# EAGLE design drive_new2 (EAGLE 9.5.0)
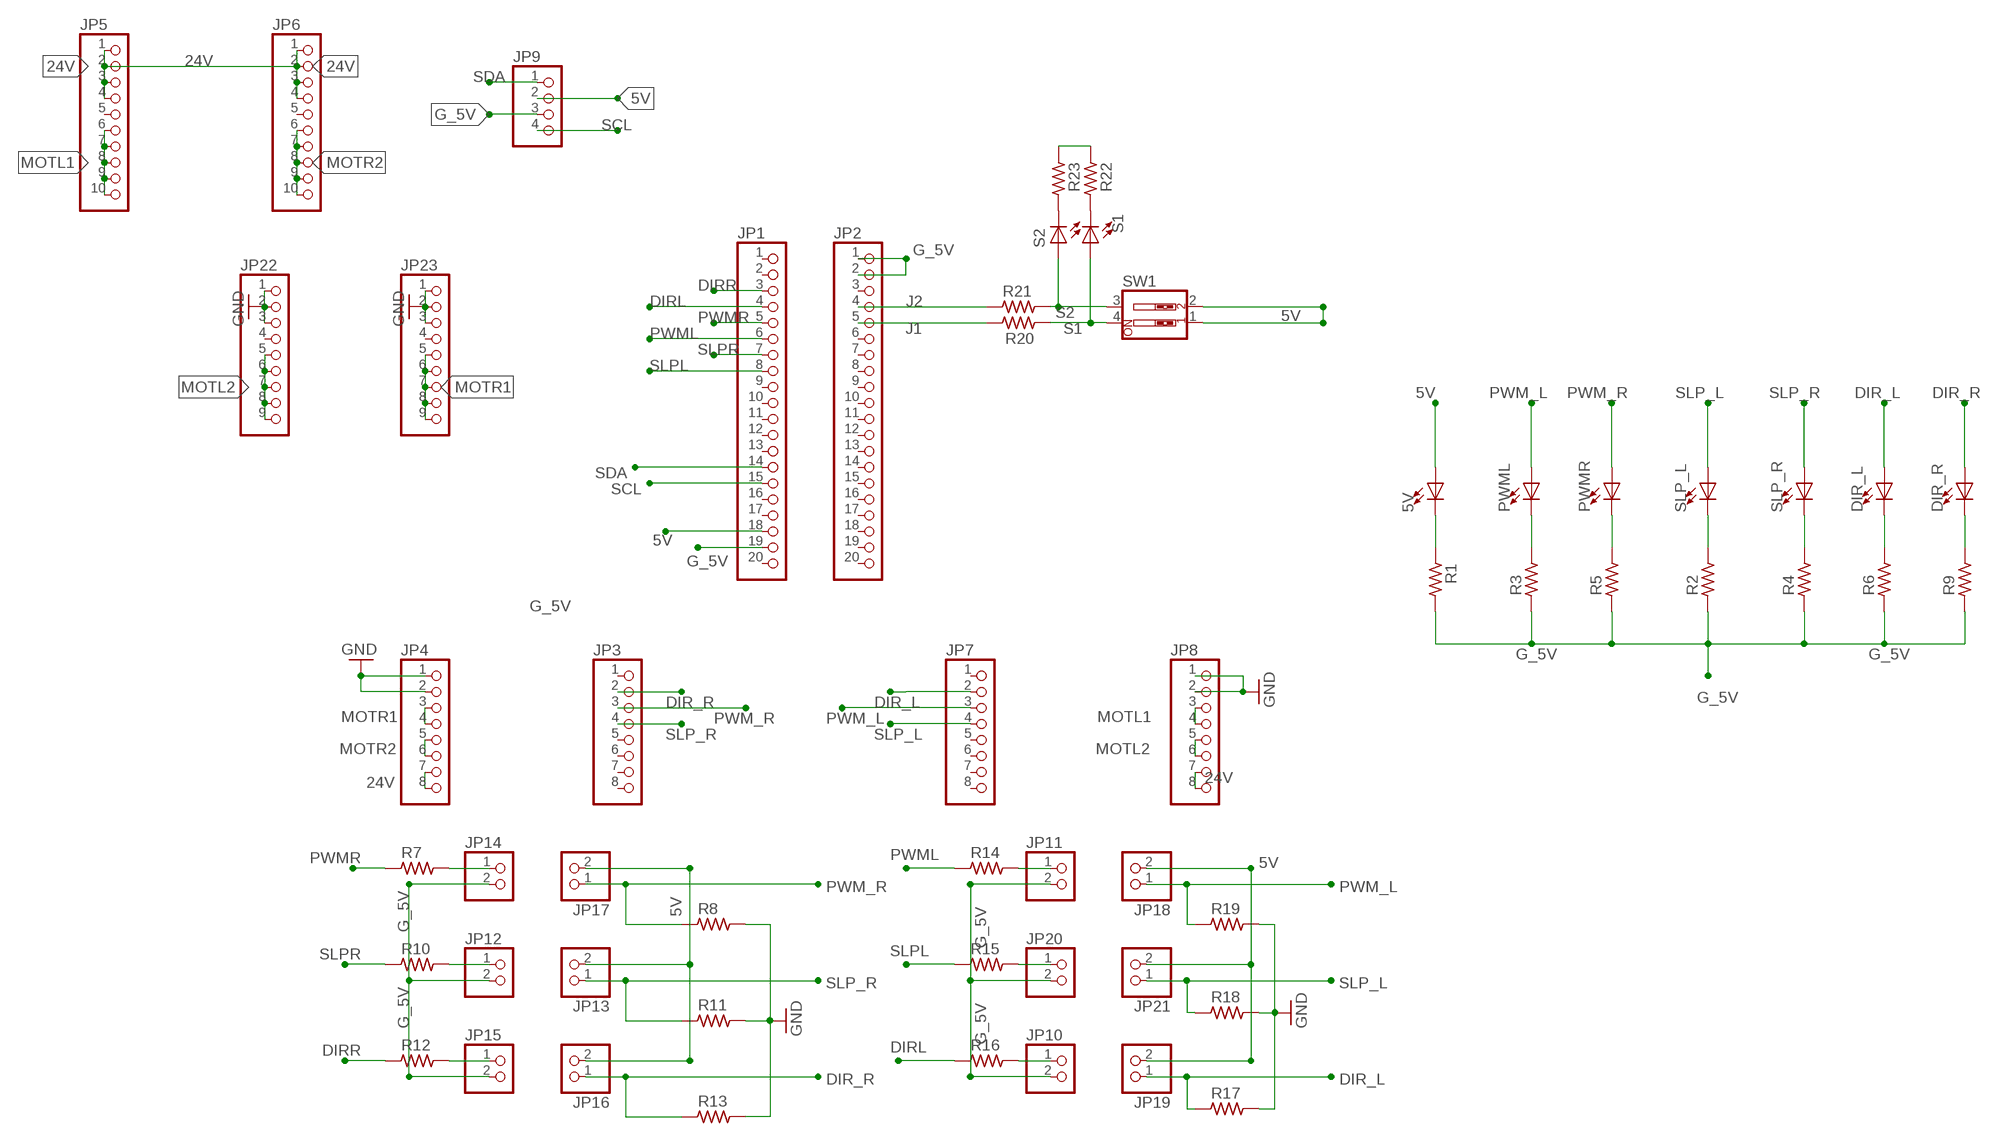
[diagram p0: schematic, sheet 1]

## Parts
5V  RED  LED_E  [LED_1206]
DIR_L  BLUE  LED_E  [LED_1206]
DIR_R  BLUE  LED_E  [LED_1206]
JP1  PINHD-1X20  [1X20]
JP2  PINHD-1X20  [1X20]
JP3  PINHD-1X8  [1X08]
JP4  PINHD-1X8  [1X08]
JP5  PINHD-1X10  [1X10]
JP6  PINHD-1X10  [1X10]
JP7  PINHD-1X8  [1X08]
JP8  PINHD-1X8  [1X08]
JP9  PINHD-1X4  [1X04]
JP10  PINHD-1X2  [1X02]
JP11  PINHD-1X2  [1X02]
JP12  PINHD-1X2  [1X02]
JP13  PINHD-1X2  [1X02]
JP14  PINHD-1X2  [1X02]
JP15  PINHD-1X2  [1X02]
JP16  PINHD-1X2  [1X02]
JP17  PINHD-1X2  [1X02]
JP18  PINHD-1X2  [1X02]
JP19  PINHD-1X2  [1X02]
JP20  PINHD-1X2  [1X02]
JP21  PINHD-1X2  [1X02]
JP22  PINHD-1X9  [1X09]
JP23  PINHD-1X9  [1X09]
PWML  RED  LED_E  [LED_1206]
PWMR  RED  LED_E  [LED_1206]
R1  R_0805  [R0805]
R2  R_0805  [R0805]
R3  R_0805  [R0805]
R4  R_0805  [R0805]
R5  R_0805  [R0805]
R6  R_0805  [R0805]
R7  R_0805  [R0805]
R8  R_0805  [R0805]
R9  R_0805  [R0805]
R10  R_0805  [R0805]
R11  R_0805  [R0805]
R12  R_0805  [R0805]
R13  R_0805  [R0805]
R14  R_0805  [R0805]
R15  R_0805  [R0805]
R16  R_0805  [R0805]
R17  R_0805  [R0805]
R18  R_0805  [R0805]
R19  R_0805  [R0805]
R20  R_0805  [R0805]
R21  R_0805  [R0805]
R22  R_0805  [R0805]
R23  R_0805  [R0805]
S1  RED  LED_E  [LED_1206]
S2  RED  LED_E  [LED_1206]
SLP_L  BLUE  LED_E  [LED_1206]
SLP_R  BLUE  LED_E  [LED_1206]
SW1  SW_DIP-2  [EDG-02]

## Nets
5V: 5V.A JP1.18 JP9.2 JP13.2 JP16.2 JP17.2 JP18.2 JP19.2 JP21.2 SW1.1 SW1.2
24V: JP4.7 JP4.8 JP5.1 JP5.2 JP5.3 JP5.4 JP6.1 JP6.2 JP6.3 JP6.4 JP8.7 JP8.8
DIR_L: DIR_L.A JP7.2 JP19.1 R17.1
DIR_R: DIR_R.A JP3.2 JP16.1 R13.1
DIRL: JP1.4 R16.1
DIRR: JP1.3 R12.1
G_5V: JP1.19 JP2.1 JP2.2 JP9.3 JP10.2 JP11.2 JP12.2 JP14.2 JP15.2 JP20.2 R1.2 R2.1 R3.1 R4.1 R5.1 R6.1 R9.1 R22.1 R23.1
GND: JP4.1 JP4.2 JP8.1 JP8.2 JP22.1 JP22.2 JP22.3 JP23.1 JP23.2 JP23.3 R8.2 R11.2 R13.2 R17.2 R18.2 R19.2
J1: JP2.5 R20.2
J2: JP2.4 R21.2
MOTL1: JP5.6 JP5.7 JP5.8 JP5.9 JP5.10 JP8.3 JP8.4
MOTL2: JP8.5 JP8.6 JP22.5 JP22.6 JP22.7 JP22.8 JP22.9
MOTR1: JP4.3 JP4.4 JP23.5 JP23.6 JP23.7 JP23.8 JP23.9
MOTR2: JP4.5 JP4.6 JP6.6 JP6.7 JP6.8 JP6.9 JP6.10
N$1: DIR_R.C R9.2
N$2: DIR_L.C R6.2
N$3: R4.2 SLP_R.C
N$4: R2.2 SLP_L.C
N$8: PWMR.C R5.2
N$9: PWML.C R3.2
N$10: 5V.C R1.1
N$11: JP14.1 R7.2
N$13: JP12.1 R10.2
N$14: R22.2 S1.C
N$15: JP15.1 R12.2
N$16: R23.2 S2.C
N$19: JP11.1 R14.2
N$20: JP20.1 R15.2
N$21: JP10.1 R16.2
PWM_L: JP7.3 JP18.1 PWML.A R19.1
PWM_R: JP3.3 JP17.1 PWMR.A R8.1
PWML: JP1.6 R14.1
PWMR: JP1.5 R7.1
S1: R20.1 S1.A SW1.4
S2: R21.1 S2.A SW1.3
SCL: JP1.15 JP9.4
SDA: JP1.14 JP9.1
SLP_L: JP7.4 JP21.1 R18.1 SLP_L.A
SLP_R: JP3.4 JP13.1 R11.1 SLP_R.A
SLPL: JP1.8 R15.1
SLPR: JP1.7 R10.1
Unconnected: JP1.1 JP1.2 JP1.9 JP1.10 JP1.11 JP1.12 JP1.13 JP1.16 JP1.17 JP1.20 JP2.3 JP2.6 JP2.7 JP2.8 JP2.9 JP2.10 JP2.11 JP2.12 JP2.13 JP2.14 JP2.15 JP2.16 JP2.17 JP2.18 JP2.19 JP2.20 JP3.1 JP3.5 JP3.6 JP3.7 JP3.8 JP5.5 JP6.5 JP7.1 JP7.5 JP7.6 JP7.7 JP7.8 JP22.4 JP23.4

## Library data of the parts
5V DIR_L DIR_R PWML PWMR S1 S2 SLP_L SLP_R = eagle-ltspice:LED_E: LED Source: http://www.osram.convergy.de Source: www.luxeon.com Source: www.kingbright.com; SPICEMODEL: NONE; SPICEPREFIX: D; SPICETYPE: diode
JP1 JP2 = pinhead:PINHD-1X20: PIN HEADER
JP3 JP4 JP7 JP8 = pinhead:PINHD-1X8: PIN HEADER
JP5 JP6 = pinhead:PINHD-1X10: PIN HEADER
JP9 = pinhead:PINHD-1X4: PIN HEADER
JP10-JP21 = pinhead:PINHD-1X2: PIN HEADER
JP22 JP23 = pinhead:PINHD-1X9: PIN HEADER
R1-R23 = rc-master-smd:R_: RESISTOR
SW1 = special:SW_DIP-2: DIP SWITCH

## Board
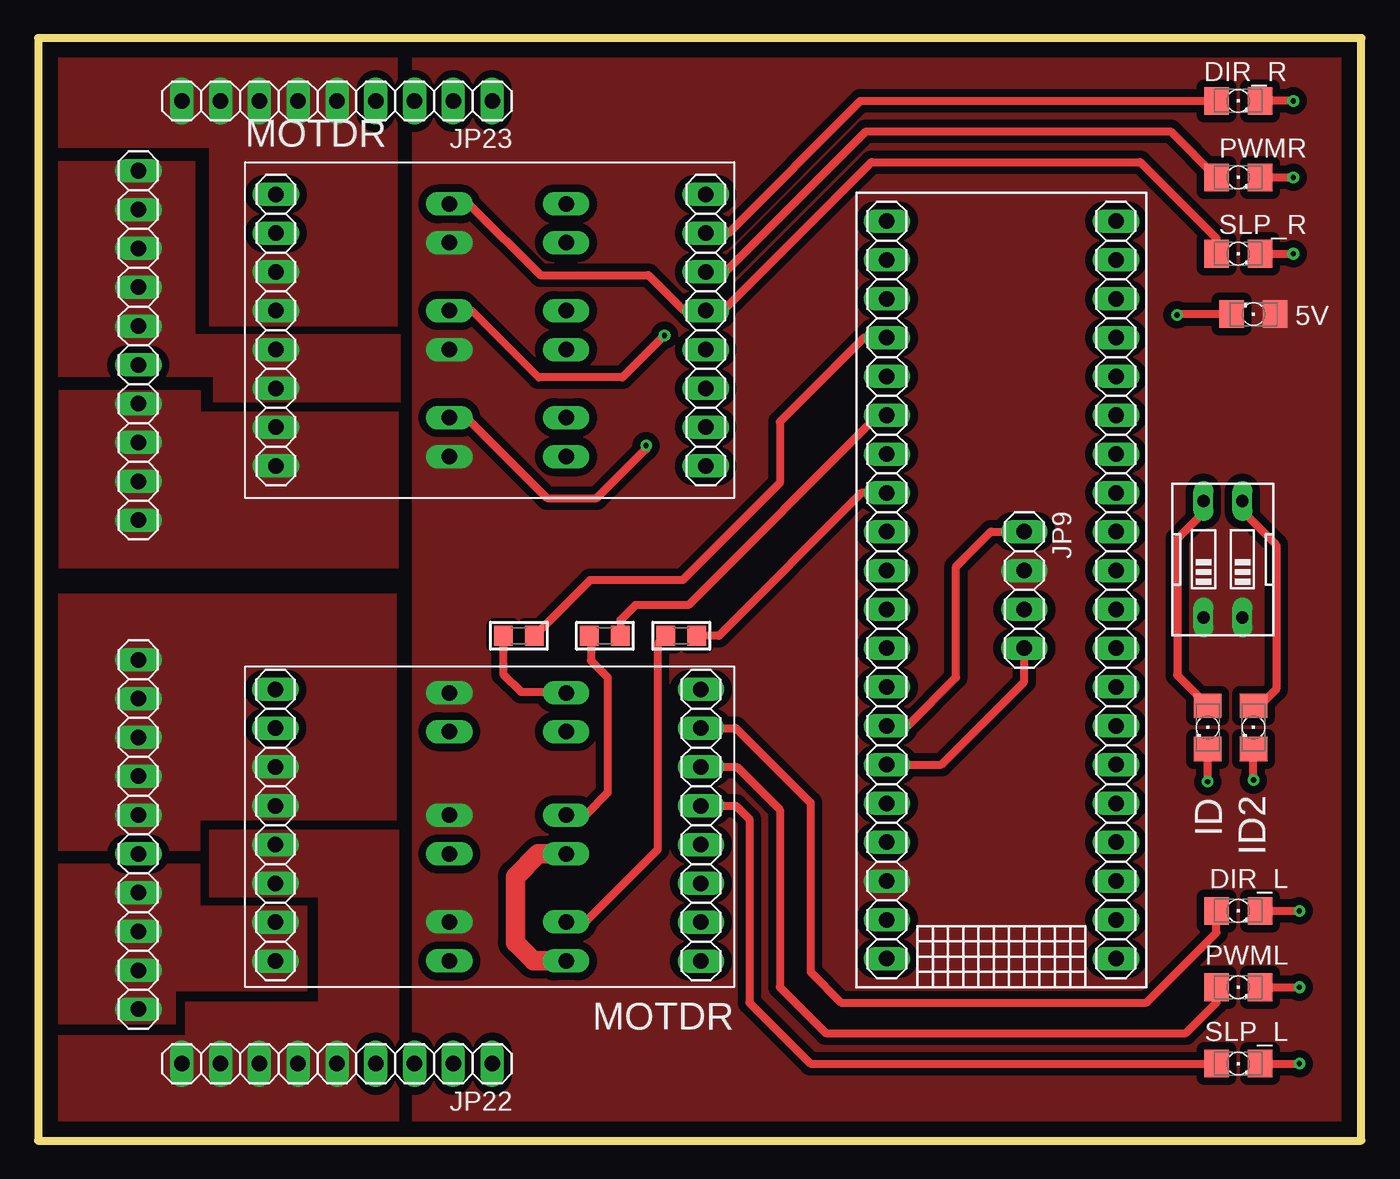
[diagram p1: board, top side]
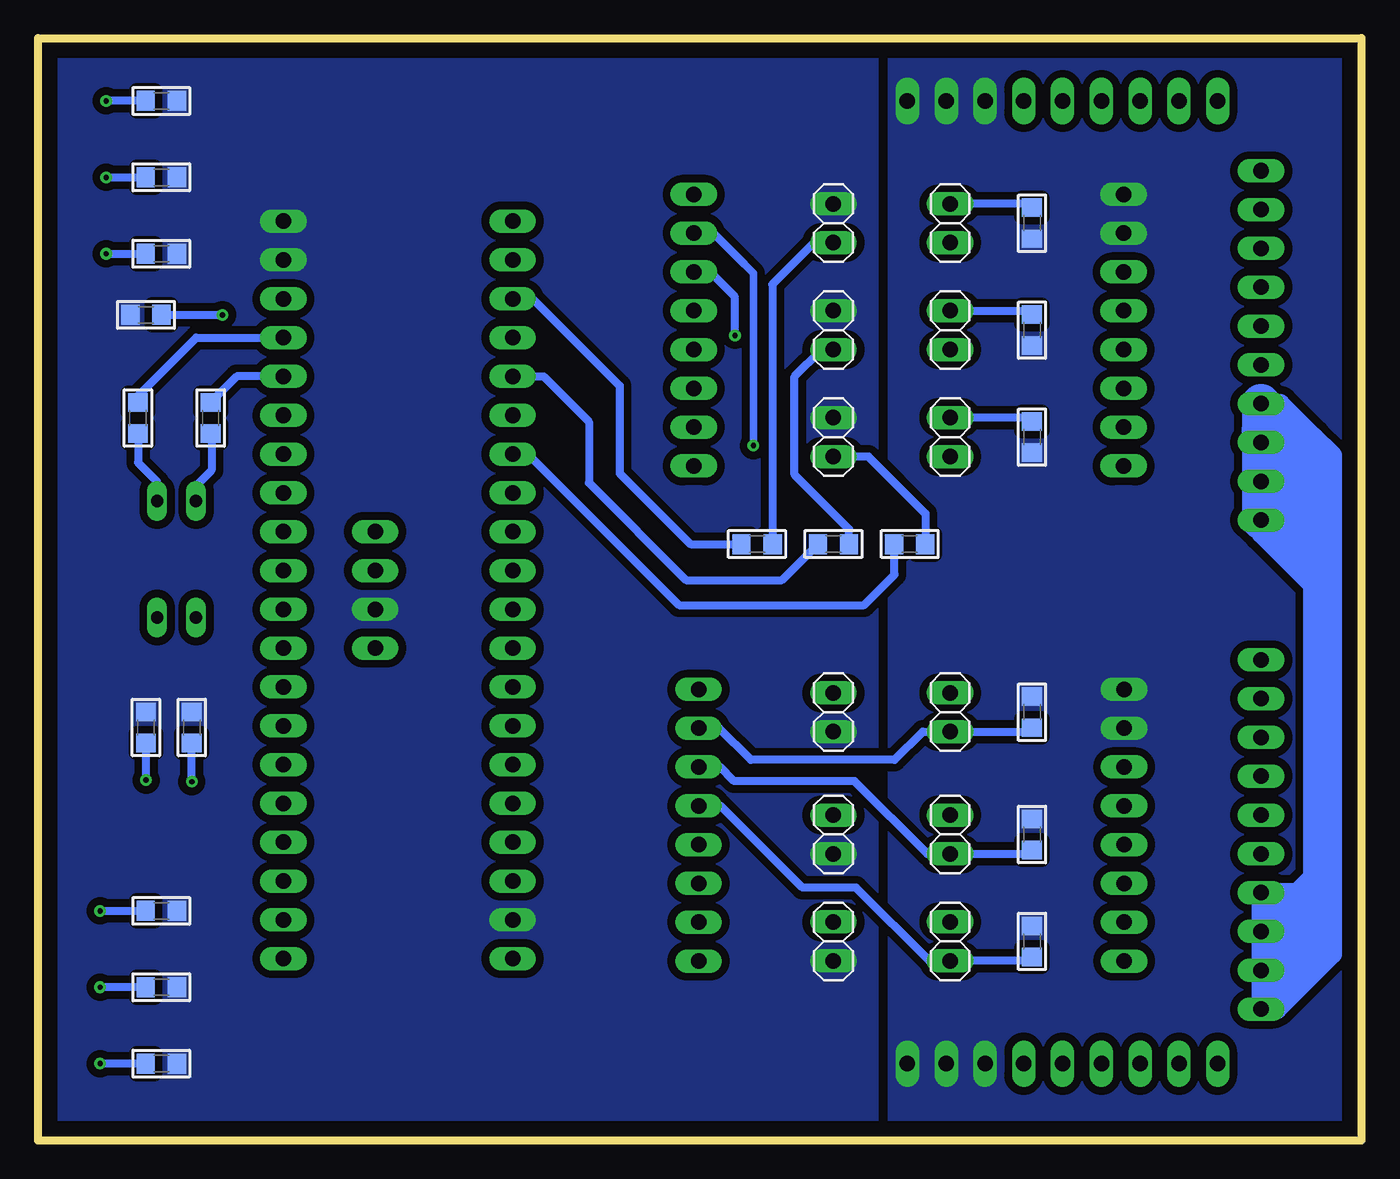
[diagram p2: board, bottom side, seen from below]

Size 86.61 x 72.14 mm. Coordinates in mm from the lower left corner, seen from the top.
Outline: 0,0 86.61,0 86.61,72.14 0,72.14 0,0
Copper layers (1*16): Top 0.035mm / dielectric 1.5mm / Bottom 0.035mm
Design rules "default *": minimum track width 6mil, minimum drill 0.35mm, track to track 20mil, track to pad 20mil, pad to pad 20mil, via to via 20mil, smd to smd 20mil, copper to edge 40mil, drill to drill 6mil, minimum pad ring 10mil, minimum via ring 8mil, stop-mask expansion 4mil, vias tented up to drill 0mil, thermal gap 10mil

### Footprints (pad centres in the part's own frame; a part is rotated, then mirrored left to right if it is on the bottom)
LED_1206 = smd 1.6 x 1.803: A -1.422,0; C 1.422,0
1X20 = drill 1.016 long: 1 -24.13,0; 2 -21.59,0; 3 -19.05,0; 4 -16.51,0; 5 -13.97,0; 6 -11.43,0; 7 -8.89,0; 8 -6.35,0; 9 -3.81,0; 10 -1.27,0; 11 1.27,0; 12 3.81,0; 13 6.35,0; 14 8.89,0; 15 11.43,0; 16 13.97,0; 17 16.51,0; 18 19.05,0; 19 21.59,0; 20 24.13,0
1X08 = drill 1.016 long: 1 -8.89,0; 2 -6.35,0; 3 -3.81,0; 4 -1.27,0; 5 1.27,0; 6 3.81,0; 7 6.35,0; 8 8.89,0
1X10 = drill 1.016 long: 1 -11.43,0; 2 -8.89,0; 3 -6.35,0; 4 -3.81,0; 5 -1.27,0; 6 1.27,0; 7 3.81,0; 8 6.35,0; 9 8.89,0; 10 11.43,0
1X04 = drill 1.016 long: 1 -3.81,0; 2 -1.27,0; 3 1.27,0; 4 3.81,0
1X02 = drill 1.016 long: 1 -1.27,0; 2 1.27,0
1X09 = drill 1.016 long: 1 -10.16,0; 2 -7.62,0; 3 -5.08,0; 4 -2.54,0; 5 0,0; 6 2.54,0; 7 5.08,0; 8 7.62,0; 9 10.16,0
R0805 = smd 1.2 x 1.3: 1 -1.016,0; 2 1.016,0
EDG-02 = drill 0.813 long: 1 -1.27,-3.81; 2 1.27,-3.81; 3 1.27,3.81; 4 -1.27,3.81

### Placement (x,y rotation side)
5V  79.56,54.08 180 top
DIR_L  78.56,15.03 0 top
DIR_R  78.56,68.03 0 top
JP1  55.56,36.03 270 top
JP2  70.56,36.03 270 top
JP3  43.7,53.03 270 top
JP4  15.56,53.03 270 top
JP5  6.56,20.03 90 top
JP6  6.56,52.03 90 top
JP7  43.39,20.64 270 top
JP8  15.53,20.64 270 top
JP9  64.56,36.03 270 top
JP10  34.56,28.03 270 bottom
JP11  34.56,20.03 270 bottom
JP12  34.56,46.03 90 bottom
JP13  26.92,60.03 270 bottom
JP14  34.56,53.03 90 bottom
JP15  34.56,60.03 90 bottom
JP16  26.92,46.03 270 bottom
JP17  26.92,53.03 270 bottom
JP18  26.92,20.03 90 bottom
JP19  26.92,28.03 90 bottom
JP20  34.56,13.03 270 bottom
JP21  26.92,13.03 90 bottom
JP22  19.56,5.03 180 top
JP23  19.56,68.03 180 top
PWML  78.56,10.03 0 top
PWMR  78.56,63.03 0 top
R1  79.56,54.03 180 bottom
R2  78.56,5.03 180 bottom
R3  78.56,10.03 180 bottom
R4  78.56,58.03 180 bottom
R5  78.56,63.03 180 bottom
R6  78.56,15.03 180 bottom
R7  34.56,39.03 0 bottom
R8  21.56,53.03 270 bottom
R9  78.56,68.03 180 bottom
R10  29.56,39.03 0 bottom
R11  21.56,60.03 270 bottom
R12  39.56,39.03 0 bottom
R13  21.56,46.03 270 bottom
R14  37.1,33.03 180 top
R15  42.1,33.03 180 top
R16  31.46,33.03 180 top
R17  21.56,28.03 90 bottom
R18  21.56,13.03 90 bottom
R19  21.56,20.03 90 bottom
R20  75.32,47.29 90 bottom
R21  80.08,47.29 90 bottom
R22  76.56,27.03 270 bottom
R23  79.56,27.03 270 bottom
S1  76.56,27.03 270 top
S2  79.56,27.03 270 top
SLP_L  78.56,5.03 0 top
SLP_R  78.56,58.03 0 top
SW1  77.56,38.03 0 top

### Tracks (layer width: path | path; a pad name or v marks a point on that pad's centre or on a via)
5V
  pour Top (no thermals): 24.56,75.84 90.91,75.84 90.91,-3.95 24.56,-3.95
24V
  Bottom 1.27: JP5.1 3.17,11.98 3.17,13.46 | 3.17,43.94 3.17,42.67 | 3.17,42.67 3.17,41.4 | 3.17,41.4 3.17,38.86 | 3.17,38.86 3.17,37.59 | 3.17,37.59 3.17,36.32 | 3.17,36.32 3.17,17.27 | 3.17,17.27 3.17,16 | 3.17,16 3.17,14.73 | 3.17,14.73 3.17,13.46 | JP6.1 4.03,40.6 3.56,40.13 | JP6.3 3.55,42.67 3.17,42.67 | JP6.2 3.56,40.14 3.56,40.13 | 3.17,41.4 5.71,43.94 6.1,43.94 | 3.17,43.94 5.71,46.48 6.56,46.48 | JP6.1 3.55,37.59 3.17,37.59 | JP6.1 6.09,40.13 3.56,40.13 | JP6.1 4.82,38.86 3.17,38.86 | JP6.1 6.56,39.7 3.17,36.32 | JP6.4 6.1,48.22 | 6.1,48.22 5.3,48.22 3.17,46.1 | 3.17,46.1 3.17,43.94 | 3.17,46.1 3.98,46.1 6.1,48.22 | 3.17,46.1 1.91,44.83 1.91,12.19 5.5,8.6 JP5.1 | JP5.1 6.56,12.19 | 6.56,14.73 6.56,12.19 | 6.56,14.73 6.56,16 | 6.56,16 JP5.4 | JP5.2 5.5,11.14 | 5.5,11.14 4.63,12 | 4.63,12 3.17,13.46 | JP5.3 4.22,13.68 3.17,14.73 | JP5.4 4.83,16.22 | 4.83,16.22 4.22,16.22 3.17,17.27 | 3.17,16 4,15.18 | 4,15.18 4.45,14.73 6.1,14.73 | 4.83,16.22 5.05,16 6.56,16 | 6.56,12.19 6.37,12 4.63,12 | 6.56,12.19 6.1,12.19 4.83,13.46 6.1,14.73 | 6.1,14.73 6.56,14.73 | 4,15.18 5.05,16.22 JP5.4 | JP5.1 5.5,9.66 5.5,11.14
  Bottom 2.54: JP6.4 6.56,46.48 JP6.1
  pour Top (no thermals): -1.16,18.03 10.52,18.03 10.52,15.3 17.56,15.3 17.56,9.83 8.95,9.83 8.95,7.68 -1.16,7.68
  pour Top (no thermals): 10.56,47.63 23.53,47.63 23.53,37.52 0.75,37.52 0.75,49.03 10.56,49.03
DIR_L
  Top 0.508: JP7.2 45.68,26.99 50.56,22.11 50.56,11.03 52.56,9.03 72.56,9.03 77.13,13.61 DIR_L.A
  Bottom 0.508: R17.1 21.81,26.76 JP19.1 28.7,26.76 30.56,24.91 39.95,24.91 42.03,26.99 JP7.2
DIR_R  (via drill 0.35)
  Top 0.508: JP16.1 28.05,47.3 33.32,42.03 36.56,42.03 39.77,45.25 39.79,45.22 v39.79,45.48 | JP3.2 45.18,59.38 53.83,68.03 DIR_R.A
  Bottom 0.5: v39.79,45.48 39.79,56.76 40.35,57.31
  Bottom 0.508: R13.1 21.81,47.3 JP16.1 | JP3.2 42.41,59.38 40.35,57.31
DIRL
  Top 0.508: JP1.4 54.07,52.54 48.56,47.03 48.56,43.03 42.19,36.67 36.11,36.67 R16.1
DIRR
  Bottom 0.508: JP1.3 55.51,55.03 54.19,55.03 48.56,49.4 48.56,43.67 43.92,39.03 R12.1
G_5V
  Top 1.27: JP11.2 32.73,18.76 31.24,17.27 31.24,12.95 32.43,11.76 JP20.2
  pour Bottom (no thermals): 31.67,77.75 31.67,-5.86 92.18,-5.86 92.18,77.75
GND
  pour Bottom (no thermals): 0.24,77.38 30.92,77.38 30.92,0.24 0.24,0.24
J1
  Bottom 0.508: JP2.5 73.62,50 R20.2
J2
  Bottom 0.508: JP2.4 76.28,52.54 80.08,48.75 R21.2
MOTL1
  pour Top (no thermals): -0.52,19.03 10.54,19.03 10.54,21.03 23.4,21.03 23.4,35.72 -0.52,35.72
MOTL2
  pour Top (no thermals): 11.27,20.29 11.27,15.99 18.4,15.99 18.4,9.03 9.68,9.03 9.68,6.83 -1.79,6.83 -1.79,-0.14 23.56,-0.14 23.56,20.29
MOTR1
  pour Top (no thermals): 11.26,53.35 23.48,53.35 23.48,74.48 -1.97,74.48 -1.97,65.03 11.26,65.03
MOTR2
  pour Top (no thermals): 0.11,64.03 10.23,64.03 10.23,52.68 23.65,52.68 23.65,48.36 11.54,48.36 11.54,50.03 0.11,50.03
N$1  (via drill 0.35)
  Top 0.508: v82.16,68.03 DIR_R.C
  Bottom 0.508: R9.2 v82.16,68.03
N$2  (via drill 0.35)
  Top 0.508: v82.56,15.03 v82.55,15.03 DIR_L.C
  Bottom 0.508: v82.56,15.03 R6.2
N$3  (via drill 0.35)
  Top 0.508: SLP_R.C v82.16,58.03
  Bottom 0.508: v82.16,58.03 R4.2
N$4  (via drill 0.35)
  Top 0.508: SLP_L.C v82.56,5.03
  Bottom 0.508: R2.2 v82.56,5.03
N$8  (via drill 0.35)
  Top 0.508: PWMR.C v82.16,63.03
  Bottom 0.508: v82.16,63.03 R5.2
N$9  (via drill 0.35)
  Top 0.508: PWML.C v82.56,10.03
  Bottom 0.508: R3.2 v82.56,10.03
N$10  (via drill 0.35)
  Top 0.508: v74.56,54.03 74.6,54.08 5V.C
  Bottom 0.508: R1.1 v74.56,54.03
N$11
  Bottom 0.508: R7.2 33.54,40.02 37.09,43.57 37.09,50 35.33,51.76 JP14.1
N$13
  Bottom 0.508: R10.2 28.53,39.05 28.53,41.03 32.26,44.76 JP12.1
N$14  (via drill 0.35)
  Top 0.508: v76.56,23.48 S1.C
  Bottom 0.508: v76.56,23.48 R22.2
N$15
  Bottom 0.508: JP15.1 35.83,58.76 38.56,56.03 38.56,39.05 R12.2
N$16  (via drill 0.35)
  Top 0.508: v79.56,23.59 S2.C
  Bottom 0.508: v79.56,23.59 R23.2
N$19
  Top 0.508: JP11.1 35.83,21.3 37.29,22.76 37.29,30.3 36.17,31.41 36.17,32.94 R14.2
N$20
  Top 0.508: R15.2 40.56,32.51 40.56,19.03 35.83,14.3 JP20.1
N$21
  Top 0.508: R16.2 30.45,30.52 31.6,29.36 34.49,29.36 JP10.1
PWM_L
  Top 0.508: JP7.3 45.74,24.45 48.56,21.63 48.56,10.03 51.56,7.03 75.13,7.03 77.13,9.03 PWML.A
  Bottom 0.508: JP7.3 41.97,24.45 41.05,23.53 33.18,23.53 28.41,18.76 JP18.1 21.81,18.76 R19.1
PWM_R  (via drill 0.35)
  Top 0.5: JP17.1 28.4,54.3 32.77,49.94
  Top 0.508: 32.77,49.94 38.25,49.94 v41,52.69 | JP3.3 45,56.84 54.19,66.03 74.13,66.03 PWMR.A
  Bottom 0.508: 21.78,54.27 R8.1 21.81,54.3 JP17.1 | v41,52.69 41,55.21 42.63,56.84 JP3.3
PWML
  Top 0.508: JP1.6 54.99,47.46 42.56,35.03 39.1,35.03 38.11,34.05 R14.1
PWMR
  Bottom 0.508: JP1.5 53.53,50 50.56,47.03 50.56,43.03 44.19,36.67 37.94,36.67 R7.1
S1
  Top 0.508: SW1.4 76.29,41.1 74.56,39.37 74.56,30.45 S1.A
  Bottom 0.508: R20.1 75.27,46.22 75.27,43.86 76.29,42.84 SW1.4
S2
  Top 0.508: SW1.3 78.83,41.21 81.05,38.98 81.05,29.52 79.98,28.45 S2.A
  Bottom 0.508: SW1.3 78.83,43.11 80.08,44.37 R21.1
SCL
  Top 0.508: JP1.15 59.13,24.6 64.56,30.03 JP9.4
SDA
  Top 0.508: JP1.14 56.92,27.14 60.08,30.3 60.08,37.56 62.37,39.84 JP9.1
SLP_L
  Top 0.508: JP7.4 45.68,21.91 46.56,21.03 46.56,9.03 50.56,5.03 SLP_L.A
  Bottom 0.508: R18.1 21.81,11.76 JP21.1 28.29,11.76 33.07,16.55 36.58,16.55 41.94,21.91 JP7.4
SLP_R
  Top 0.508: JP13.1 26.93,61.29 28.22,61.29 32.87,56.64 39.95,56.64 42.29,54.3 JP3.4 44.83,54.3 54.56,64.03 72.13,64.03 77.13,59.03 SLP_R.A
  Bottom 0.508: R11.1 21.81,61.3 JP13.1
SLPL
  Top 0.508: JP1.8 53.91,42.38 44.56,33.03 R15.1
SLPR
  Bottom 0.508: JP1.7 54.54,44.92 44.65,35.03 32.56,35.03 30.56,37.03 30.56,39.02 R10.1

### Text on the board
tNames: MOTDR | ID | ID2 | MOTDR